# Altium project BTL_ESP32.PrjPcb
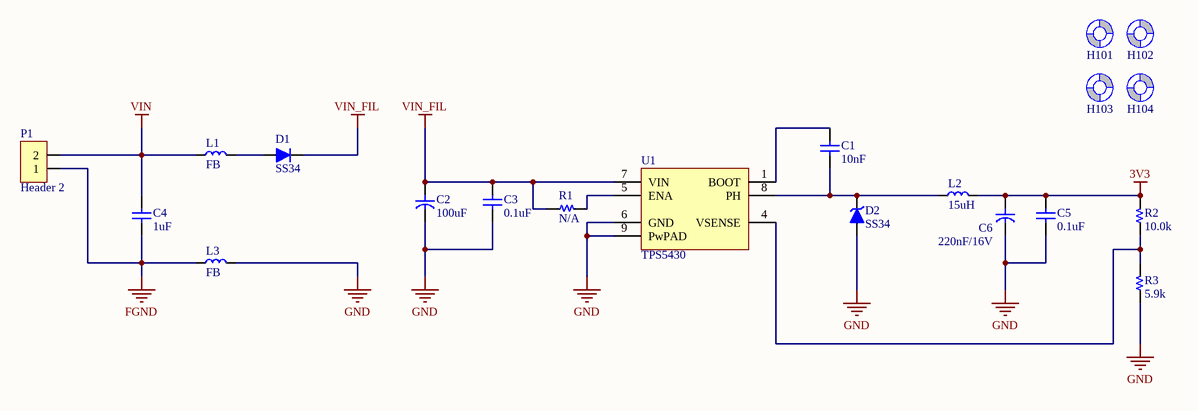
[diagram p0: Power_3V3.SchDoc]
6 sheets, 63 parts. Net scope: global (net labels, ports and power ports of the same name join across sheets).
Board file: Mainboard.PcbDoc
Sheets:
  Power_3V3.SchDoc
  ESP32_Core.SchDoc
  DIP_Switch.SchDoc
  Current_Sensor.SchDoc
  RS485.SchDoc
  LED_Driver.SchDoc

## Sheet Power_3V3.SchDoc
size A4; SheetNumber: 5; SheetTotal: 6

### Parts
C1  10nF  [C 0805]
C2  100uF  [C SMD TAN 1206 (A)]
C3  0.1uF  [C 0805]
C4  1uF  [C 0805]
C5  0.1uF  [C 0805]
C6  220nF/16V  [C SMD TAN 1206 (A)]
D1  SS34  [DO-35 (SOD27 )]
D2  SS34  [DO-214AC (SMA)]
H101  Screw Hole  [SCREW/3.2/7.0/M]  (value not drawn)  (no BOM)
H102  Screw Hole  [SCREW/3.2/7.0/M]  (value not drawn)  (no BOM)
H103  Screw Hole  [SCREW/3.2/7.0/M]  (value not drawn)  (no BOM)
H104  Screw Hole  [SCREW/3.2/7.0/M]  (value not drawn)  (no BOM)
L1  FB  [Inductor SMD 0805 (2012)]
L2  15uH  [Inductor SMD 0805 (2012)]
L3  FB  [Inductor SMD 0805 (2012)]
P1  Header 2  [HDR/Header/2/BOX/RED]
R1  N/A  [R 0805]
R2  10.0k  [R 0805]
R3  5.9k  [R 0805]
U1  TPS5430  [SOIC-8 EP]

### Nets
3V3: C5.1 C6.1 L2.2 R2.2
FGND: C4.2 L3.1 P1.1
GND: C2.2 C3.2 C5.2 C6.2 D2.1(A) L3.2 R3.1 U1.6(GND) U1.9(PwPAD)
VIN: C4.1 L1.1 P1.2
VIN_FIL: C2.1 C3.1 D1.2(K) R1.1 U1.7(VIN)
NetC1_1: C1.1 U1.1(BOOT)
NetC1_2: C1.2 D2.2(K) L2.1 U1.8(PH)
NetD1_1: D1.1(A) L1.2
NetR1_2: R1.2 U1.5(ENA)
NetR2_1: R2.1 R3.2 U1.4(VSENSE)

Not connected (* = marked no-connect by the designer): H101 1(Screw); H102 1(Screw); H103 1(Screw); H104 1(Screw)

### Library data of the parts
C1 C3-C5 = Capacitor NP: Capacitor non-pol
C2 C6 = Capacitor: Capacitor pol
D1 = Diode: Default Diode
D2 = Diode Zener: Zener Diode
L1-L3 = Inductor
P1 = Header 2: Header, 2-Pin
R1-R3 = Resistor
U1 = TPS54xx: 3/5A, Wide input range, Step-down SWIFT DC-DC Converter
H101-H104 = Screw Hole: TYPE: NO-BOM; UNIT PRICE: 0

## Sheet ESP32_Core.SchDoc
size A4; SheetNumber: 3; SheetTotal: 6
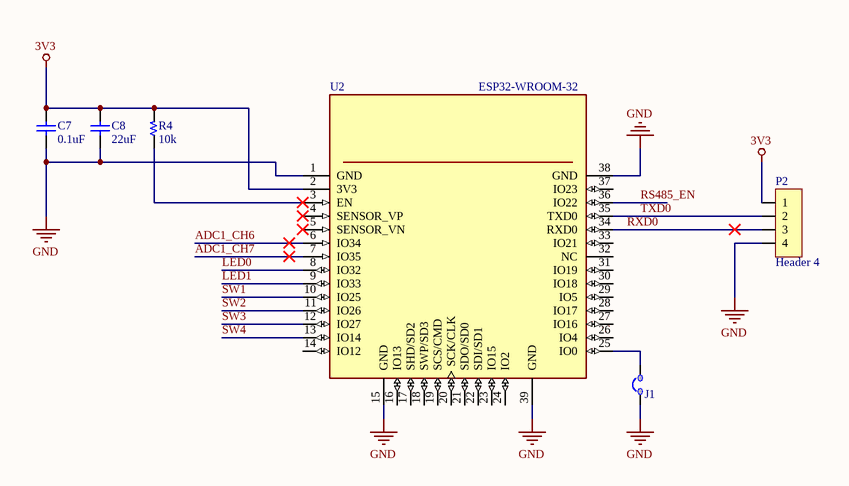
[diagram p1: ESP32_Core.SchDoc]

### Parts
C7  0.1uF  [C 0805]
C8  22uF  [C 0805]
J1  JUMP 2  [JUMP/2/Close]  (value not drawn)  (no BOM)
P2  Header 4  [HDR/Header/4]
R4  10k  [R 0805]
U2  ESP32-WROOM-32  [MODULE_ESP32-WROOM-32]

### Nets
3V3: C7.1 C8.1 P2.1 R4.2 U2.2(3V3)
GND: C7.2 C8.2 J1.1 P2.4 U2.1(GND) U2.15(GND) U2.38(GND) U2.39(GND)
ADC1_CH6: U2.6(IO34)
ADC1_CH7: U2.7(IO35)
LED0: U2.8(IO32)
LED1: U2.9(IO33)
RS485_EN: U2.36(IO22)
RXD0: P2.3 U2.34(RXD0)
SW1: U2.10(IO25)
SW2: U2.11(IO26)
SW3: U2.12(IO27)
SW4: U2.13(IO14)
TXD0: P2.2 U2.35(TXD0)
NetJ1_2: J1.2 U2.25(IO0)
NetR4_1: R4.1 U2.3(EN)

Not connected (* = marked no-connect by the designer): U2 4(SENSOR_VP)* 5(SENSOR_VN)* 14(IO12) 16(IO13) 17(SHD/SD2) 18(SWP/SD3) 19(SCS/CMD) 20(SCK/CLK) 21(SDO/SD0) 22(SDI/SD1) 23(IO15) 24(IO2) 26(IO4) 27(IO16) 28(IO17) 29(IO5) 30(IO18) 31(IO19) 32(NC) 33(IO21) 37(IO23)

### Library data of the parts
C7 C8 = Capacitor NP: Capacitor non-pol
P2 = Header 4: Header, 4-Pin
R4 = Resistor
U2 = ESP32-WROOM-32: Bluetooth, WiFi 802.11b/g/n, Bluetooth v4.2 + EDR, Class 1, 2 and 3 Transceiver Module 2.4GHz ~ 2.5GHz Integrated, Trace Surface Mount; MF: Espressif Systems; MP: ESP32-WROOM-32D; Price: None; Package: Module Espressif Systems; Availability: Unavailable; SnapEDA_Link: https://www.snapeda.com/parts/ESP32-WROOM-32D/Espressif%20Systems/view-part/2768115/?ref=snap; Value: *

## Sheet DIP_Switch.SchDoc
size A4; SheetNumber: 2; SheetTotal: 6
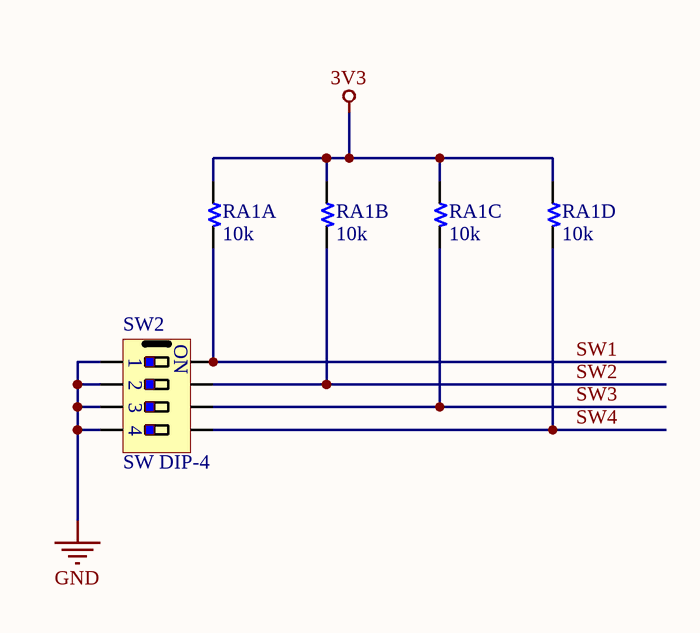
[diagram p2: DIP_Switch.SchDoc]

### Parts
RA1A  10k  [R 0805]
RA1B  10k  [R 0805]
RA1C  10k  [R 0805]
RA1D  10k  [R 0805]
SW2  SW DIP-4  [SW/DIP4]

### Nets
3V3: RA1A.1 RA1B.1 RA1C.1 RA1D.1
GND: SW2.1 SW2.2 SW2.3 SW2.4
SW1: RA1A.2 SW2.8
SW2: RA1B.2 SW2.7
SW3: RA1C.2 SW2.6
SW4: RA1D.2 SW2.5

### Notes on the sheet
- (in symbol SW DIP-4) ON

### Library data of the parts
RA1A RA1B RA1C RA1D = Resistor

## Sheet Current_Sensor.SchDoc
size A4; SheetNumber: 1; SheetTotal: 5
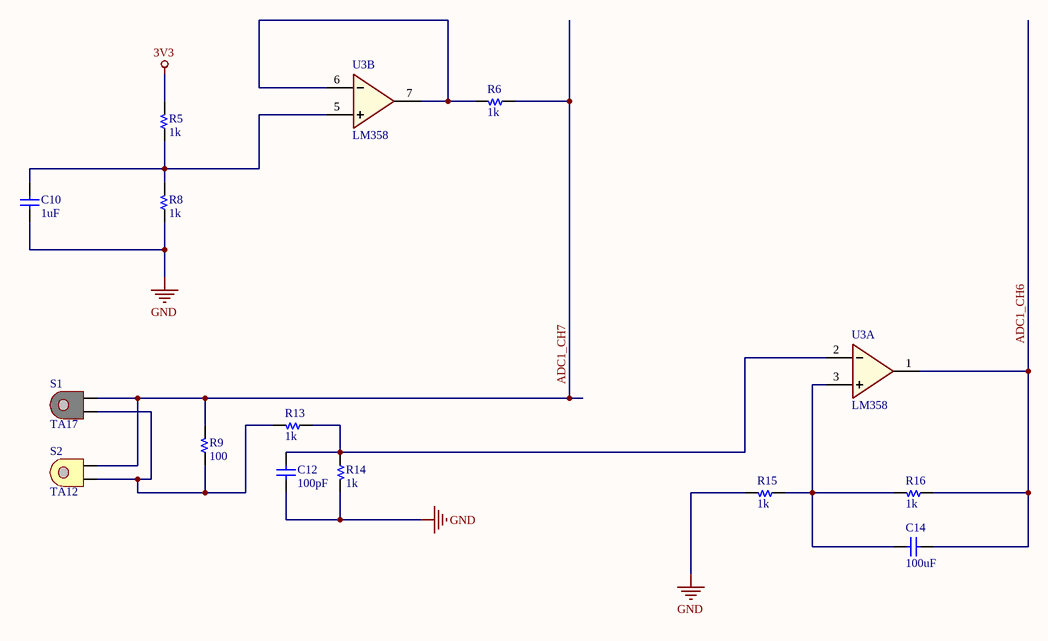
[diagram p3: Current_Sensor.SchDoc]

### Parts
C10  1uF  [C 0805]
C12  100pF  [C 0805]
C14  100uF  [C 0805]
R5  1k  [R 0805]
R6  1k  [R 0805]
R8  1k  [R 0805]
R9  100  [R 0805]
R13  1k  [R 0805]
R14  1k  [R 0805]
R15  1k  [R 0805]
R16  1k  [R 0805]
S1  TA17  [TA17]
S2  TA12  [TA12]
U3  LM358  [SOIC-8]  (parts A,B of 2)

### Nets
3V3: R5.2
GND: C10.2 C12.2 R8.1 R14.2 R15.2 U3.4(GND)
VCC: U3.8(VCC)
ADC1_CH6: C14.2 R16.1 U3.1(OutA)
ADC1_CH7: R6.1 R9.2 S1.2 S2.2
NetC10_1: C10.1 R5.1 R8.2 U3.5(B+)
NetC12_1: C12.1 R13.1 R14.1 U3.2(A-)
NetC14_1: C14.1 R15.1 R16.2 U3.3(A+)
NetR6_2: R6.2 U3.6(B-) U3.7(OutB)
NetR9_1: R9.1 R13.2 S1.1 S2.1

### Library data of the parts
C10 C12 C14 = Capacitor NP: Capacitor non-pol
R5 R6 R8 R9 R13-R16 = Resistor
U3 = LM358: Low Power Dual Operational Amplifiers

## Sheet RS485.SchDoc
size A4; SheetNumber: 6; SheetTotal: 6
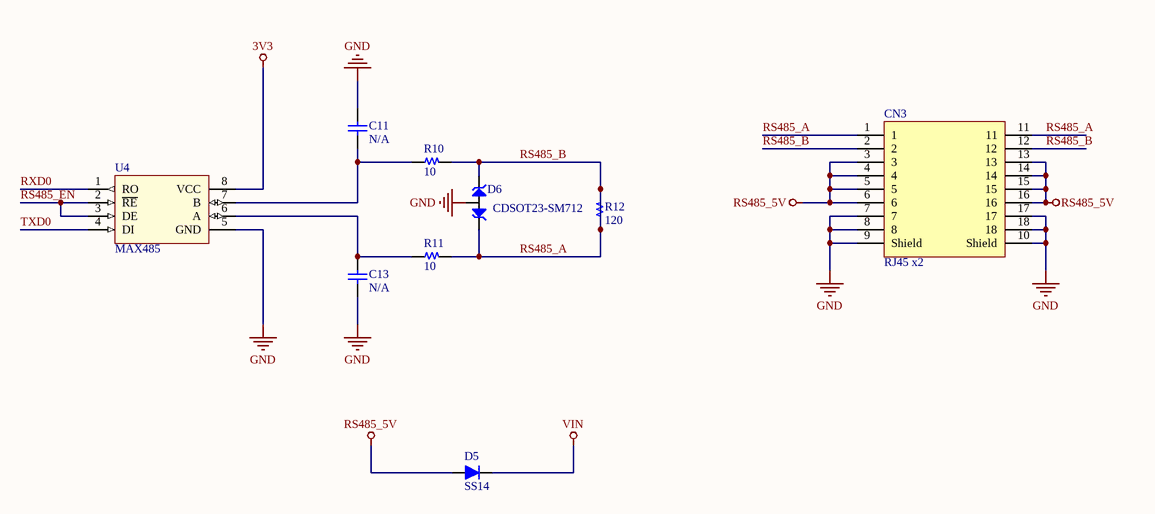
[diagram p4: RS485.SchDoc]

### Parts
C11  N/A  [C 0805]
C13  N/A  [C 0805]
CN3  RJ45 x2  [CONN/RJ45/x2]
D5  SS14  [DO-35 (SOD27 )]
D6  CDSOT23-SM712  [SOT-23]
R10  10  [R 0805]
R11  10  [R 0805]
R12  120  [R 0805]
U4  MAX485  [SOIC-8]

### Nets
3V3: U4.8(VCC)
GND: C11.1 C13.2 CN3.7 CN3.8 CN3.9(Shield) CN3.10(Shield) CN3.17 CN3.18 D6.3(COM) U4.5(GND)
RS485_5V: CN3.3 CN3.4 CN3.5 CN3.6 CN3.13 CN3.14 CN3.15 CN3.16 D5.1(A)
VIN: D5.2(K)
RS485_A: CN3.1 CN3.2 CN3.11 CN3.12 D6.1(IO1) D6.2(IO2) R10.2 R11.2 R12.1 R12.2  [also labelled RS485_B]
RS485_EN: U4.2(~{RE}) U4.3(DE)
RXD0: U4.1(RO)
TXD0: U4.4(DI)
NetC11_2: C11.2 R10.1 U4.7(B)
NetC13_1: C13.1 R11.1 U4.6(A)

### Library data of the parts
C11 C13 = Capacitor NP: Capacitor non-pol
CN3 = CON RJ45 x2: Connector RJ45 X2
D5 = Diode: Default Diode
D6 = CDSOT23-SM712: TVS DIODE 7V/12V 14V/26V SOT23-3
R10-R12 = Resistor
U4 = MAX485: Low-Power, Slew-Rate-Limited  RS-485/RS-422 Transceivers

## Sheet LED_Driver.SchDoc
size A4; SheetNumber: 4; SheetTotal: 6
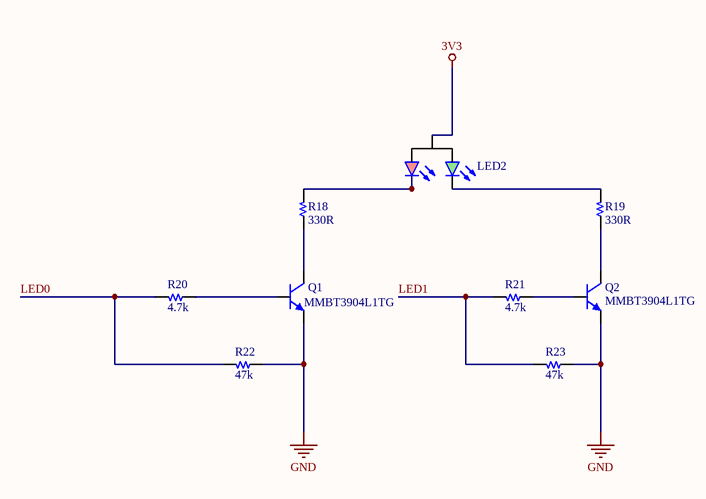
[diagram p5: LED_Driver.SchDoc]

### Parts
LED2  Led 3pin 2color  [LED 3PIN 2COLOR 5MM]  (value not drawn)
Q1  MMBT3904L1TG  [SOT-23]
Q2  MMBT3904L1TG  [SOT-23]
R18  330R  [R 0805]
R19  330R  [R 0805]
R20  4.7k  [R 0805]
R21  4.7k  [R 0805]
R22  47k  [R 0805]
R23  47k  [R 0805]

### Nets
3V3: LED2.2(A)
GND: Q1.2(E) Q2.2(E) R22.1 R23.1
LED0: R20.2 R22.2
LED1: R21.2 R23.2
NetLED2_1: LED2.1(RK) R18.2
NetLED2_3: LED2.3(YK) R19.2
NetQ1_1: Q1.1(B) R20.1
NetQ1_3: Q1.3(C) R18.1
NetQ2_1: Q2.1(B) R21.1
NetQ2_3: Q2.3(C) R19.1

### Library data of the parts
LED2 = Led 3pin 2color: Typical LED 3-pin 2-color
Q1 Q2 = Transistor NPN: NPN Bipolar Transistor
R18-R23 = Resistor

## Nets that join several sheets
3V3: Power_3V3 (C5.1 C6.1 L2.2 R2.2), ESP32_Core (5 pins), DIP_Switch (RA1A.1 RA1B.1 RA1C.1 RA1D.1), Current_Sensor (R5.2), RS485 (U4.8), LED_Driver (LED2.2)
GND: Power_3V3 (9 pins), ESP32_Core (8 pins), DIP_Switch (SW2.1 SW2.2 SW2.3 SW2.4), Current_Sensor (6 pins), RS485 (10 pins), LED_Driver (Q1.2 Q2.2 R22.1 R23.1)
VIN: Power_3V3 (C4.1 L1.1 P1.2), RS485 (D5.2)
ADC1_CH6: ESP32_Core (U2.6), Current_Sensor (C14.2 R16.1 U3.1)
ADC1_CH7: ESP32_Core (U2.7), Current_Sensor (R6.1 R9.2 S1.2 S2.2)
LED0: ESP32_Core (U2.8), LED_Driver (R20.2 R22.2)
LED1: ESP32_Core (U2.9), LED_Driver (R21.2 R23.2)
RS485_EN: ESP32_Core (U2.36), RS485 (U4.2 U4.3)
RXD0: ESP32_Core (P2.3 U2.34), RS485 (U4.1)
SW1: ESP32_Core (U2.10), DIP_Switch (RA1A.2 SW2.8)
SW2: ESP32_Core (U2.11), DIP_Switch (RA1B.2 SW2.7)
SW3: ESP32_Core (U2.12), DIP_Switch (RA1C.2 SW2.6)
SW4: ESP32_Core (U2.13), DIP_Switch (RA1D.2 SW2.5)
TXD0: ESP32_Core (P2.2 U2.35), RS485 (U4.4)